# EAGLE design audiolase (EAGLE 5.11)
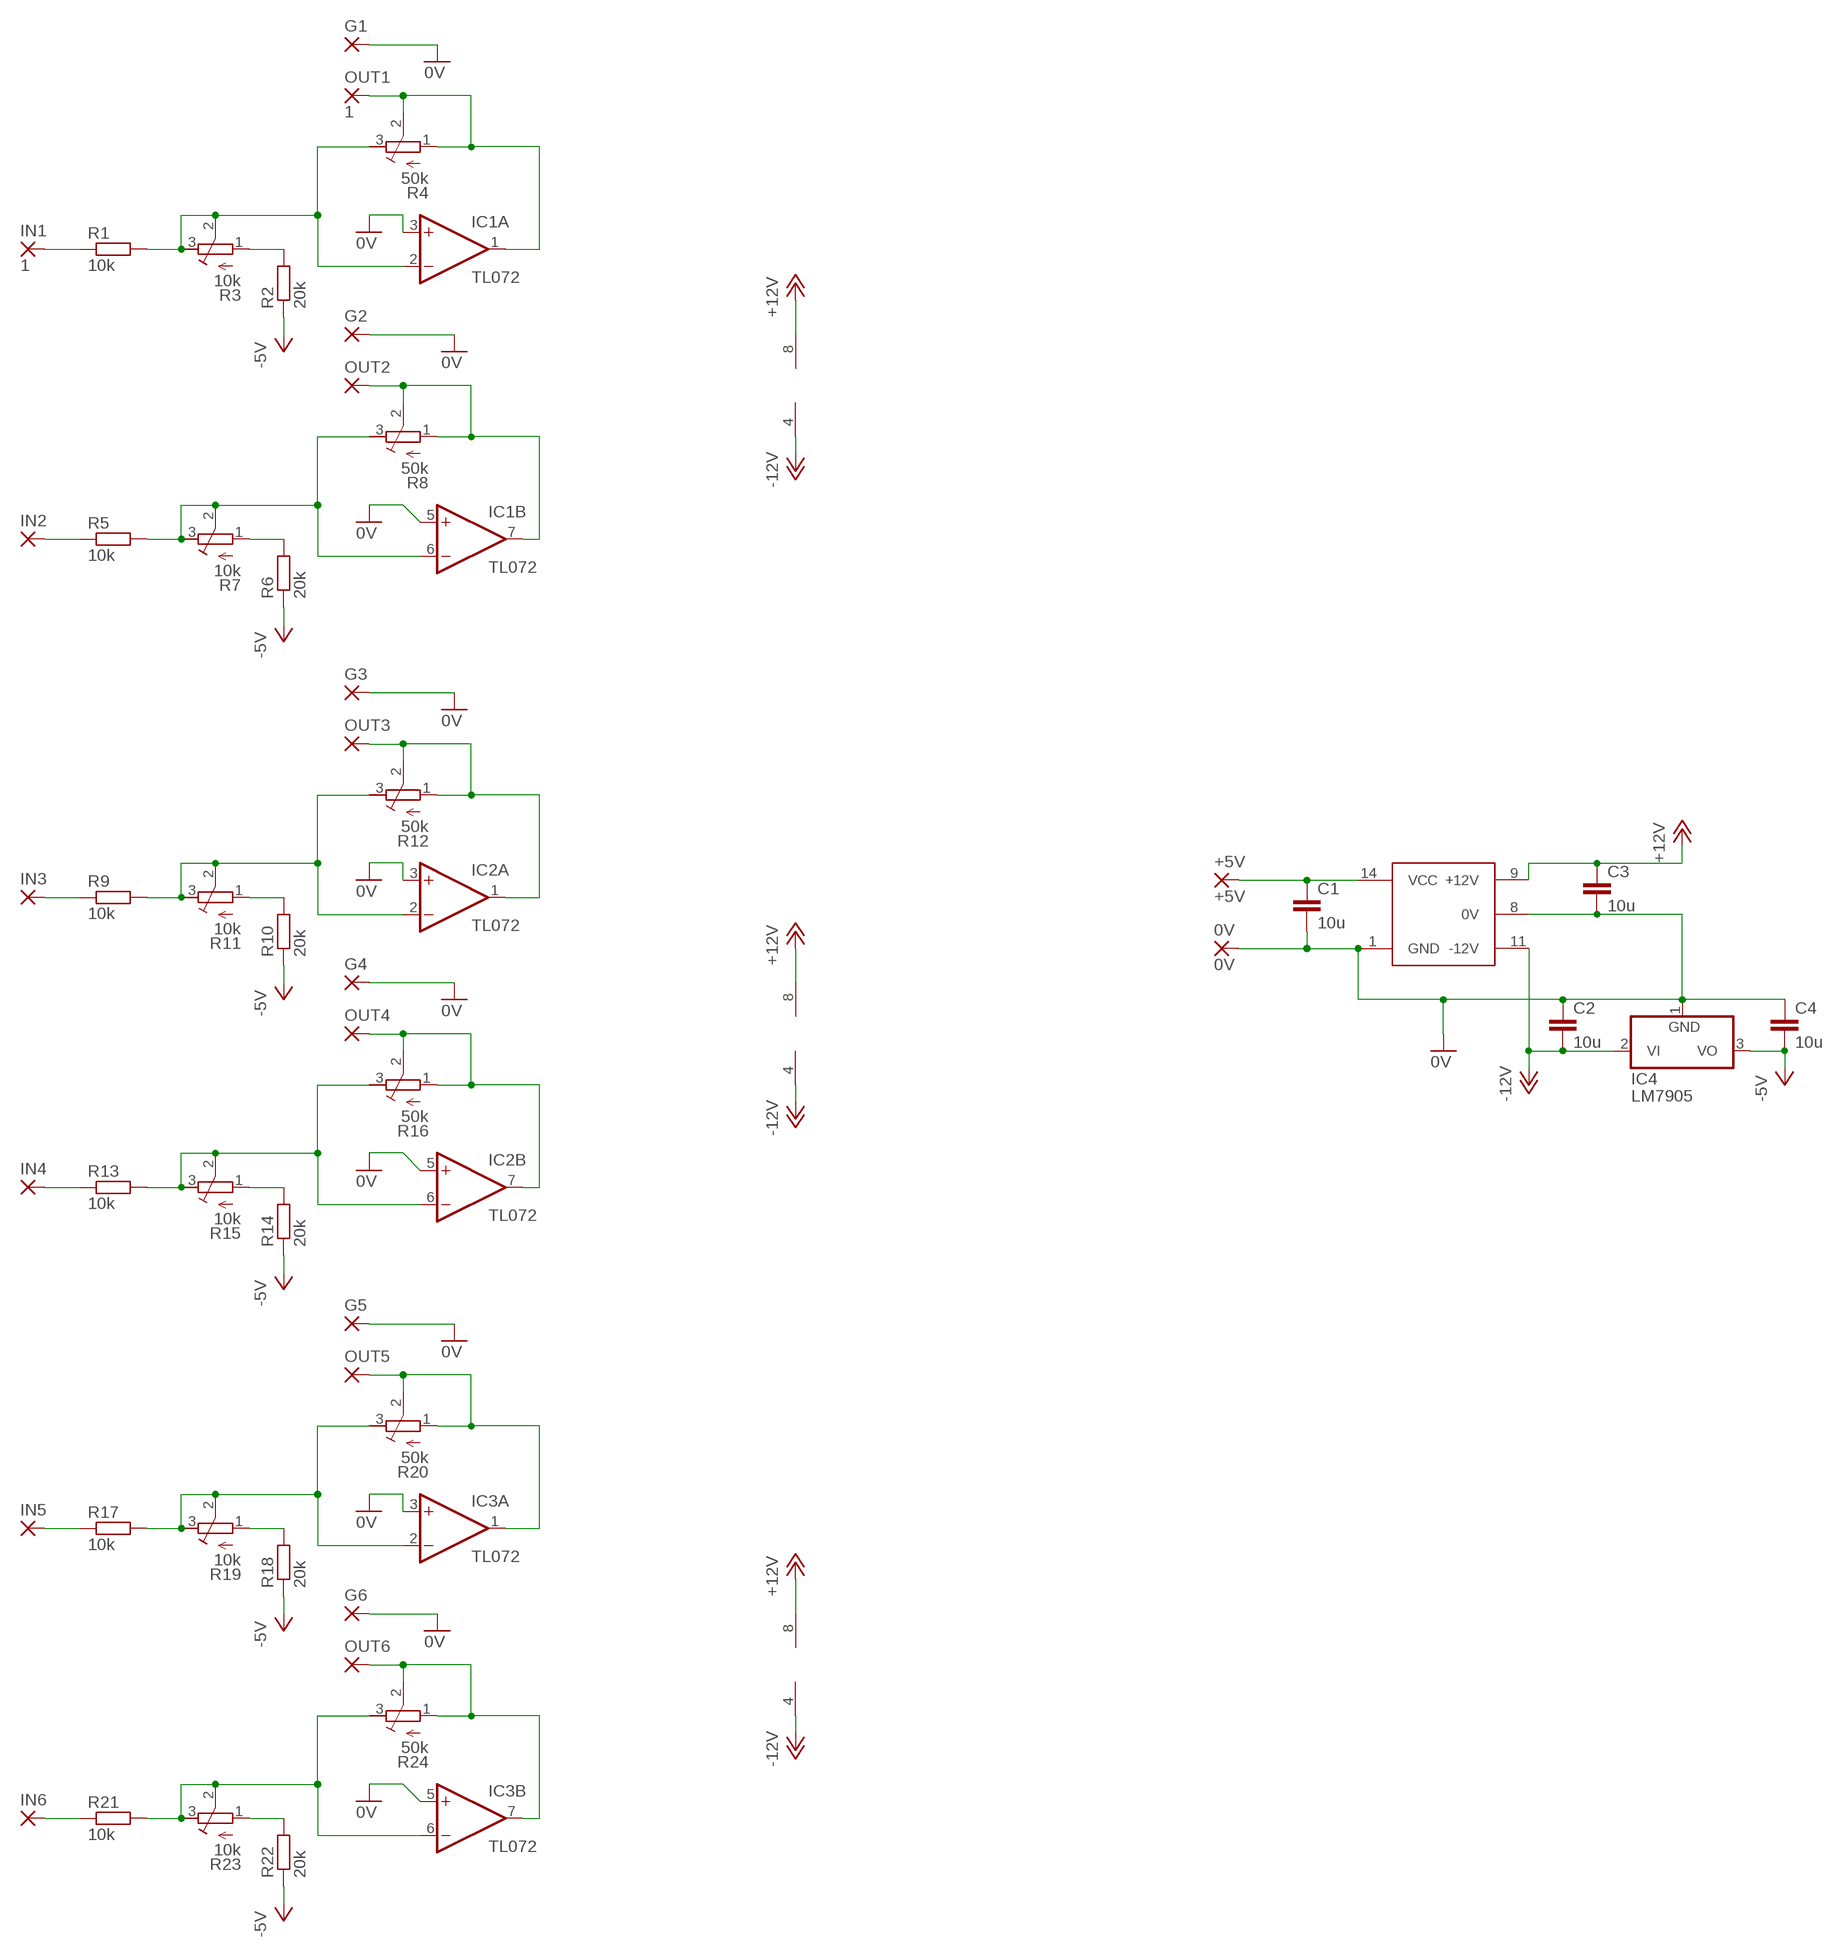
[diagram p0: schematic, sheet 1]

## Parts
0V  0V  2,54/1,0  [2,54/1,0]
+5V  +5V  2,54/1,0  [2,54/1,0]
C1  10u  C-EU075-042X103  [C075-042X103]
C2  10u  C-EU075-042X103  [C075-042X103]
C3  10u  C-EU075-042X103  [C075-042X103]
C4  10u  C-EU075-042X103  [C075-042X103]
G1  2,54/1,0  [2,54/1,0]
G2  2,54/1,0  [2,54/1,0]
G3  2,54/1,0  [2,54/1,0]
G4  2,54/1,0  [2,54/1,0]
G5  2,54/1,0  [2,54/1,0]
G6  2,54/1,0  [2,54/1,0]
IC1  TL072  2AMP_P8+4N  [DIL08]
IC2  TL072  2AMP_P8+4N  [DIL08]
IC3  TL072  2AMP_P8+4N  [DIL08]
IC4  LM7905  7905T  [TO220H]
IN1  1  2,54/1,0  [2,54/1,0]
IN2  2,54/1,0  [2,54/1,0]
IN3  2,54/1,0  [2,54/1,0]
IN4  2,54/1,0  [2,54/1,0]
IN5  2,54/1,0  [2,54/1,0]
IN6  2,54/1,0  [2,54/1,0]
OUT1  1  2,54/1,0  [2,54/1,0]
OUT2  2,54/1,0  [2,54/1,0]
OUT3  2,54/1,0  [2,54/1,0]
OUT4  2,54/1,0  [2,54/1,0]
OUT5  2,54/1,0  [2,54/1,0]
OUT6  2,54/1,0  [2,54/1,0]
R1  10k  R-EU_0207/10  [0207/10]
R2  20k  R-EU_0207/10  [0207/10]
R3  10k  R-TRIMM3299W  [RTRIM3299W]
R4  50k  R-TRIMM3299W  [RTRIM3299W]
R5  10k  R-EU_0207/10  [0207/10]
R6  20k  R-EU_0207/10  [0207/10]
R7  10k  R-TRIMM3299W  [RTRIM3299W]
R8  50k  R-TRIMM3299W  [RTRIM3299W]
R9  10k  R-EU_0207/10  [0207/10]
R10  20k  R-EU_0207/10  [0207/10]
R11  10k  R-TRIMM3299W  [RTRIM3299W]
R12  50k  R-TRIMM3299W  [RTRIM3299W]
R13  10k  R-EU_0207/10  [0207/10]
R14  20k  R-EU_0207/10  [0207/10]
R15  10k  R-TRIMM3299W  [RTRIM3299W]
R16  50k  R-TRIMM3299W  [RTRIM3299W]
R17  10k  R-EU_0207/10  [0207/10]
R18  20k  R-EU_0207/10  [0207/10]
R19  10k  R-TRIMM3299W  [RTRIM3299W]
R20  50k  R-TRIMM3299W  [RTRIM3299W]
R21  10k  R-EU_0207/10  [0207/10]
R22  20k  R-EU_0207/10  [0207/10]
R23  10k  R-TRIMM3299W  [RTRIM3299W]
R24  50k  R-TRIMM3299W  [RTRIM3299W]
U$1  IA0512D  [IA0512D]

## Nets
0V: 0V.1(P) C1.2 C2.1 C3.2 C4.1 G1.1(P) G2.1(P) G3.1(P) G4.1(P) G5.1(P) G6.1(P) IC1.3(A:+IN) IC1.5(B:+IN) IC2.3(A:+IN) IC2.5(B:+IN) IC3.3(A:+IN) IC3.5(B:+IN) IC4.1(GND) U$1.1(GND) U$1.8(0V)
+12V: C3.1 IC1.8(P:V+) IC2.8(P:V+) IC3.8(P:V+) U$1.9(+12V)
-5V: C4.2 IC4.3(VO) R2.1 R6.1 R10.1 R14.1 R18.1 R22.1
-12V: C2.2 IC1.4(P:V-) IC2.4(P:V-) IC3.4(P:V-) IC4.2(VI) U$1.11(-12V)
N$1: IN1.1(P) R1.1
N$2: IC1.2(A:-IN) R1.2 R3.2(S) R3.3(A) R4.3(A)
N$3: R2.2 R3.1(E)
N$4: IC1.1(A:OUT) OUT1.1(P) R4.1(E) R4.2(S)
N$5: IN2.1(P) R5.1
N$6: IC1.6(B:-IN) R5.2 R7.2(S) R7.3(A) R8.3(A)
N$7: IC1.7(B:OUT) OUT2.1(P) R8.1(E) R8.2(S)
N$8: R6.2 R7.1(E)
N$9: IN3.1(P) R9.1
N$10: IC2.2(A:-IN) R9.2 R11.2(S) R11.3(A) R12.3(A)
N$11: IC2.1(A:OUT) OUT3.1(P) R12.1(E) R12.2(S)
N$12: R10.2 R11.1(E)
N$13: IN4.1(P) R13.1
N$14: IC2.6(B:-IN) R13.2 R15.2(S) R15.3(A) R16.3(A)
N$15: IC2.7(B:OUT) OUT4.1(P) R16.1(E) R16.2(S)
N$16: R14.2 R15.1(E)
N$17: IN5.1(P) R17.1
N$18: IC3.2(A:-IN) R17.2 R19.2(S) R19.3(A) R20.3(A)
N$19: IC3.1(A:OUT) OUT5.1(P) R20.1(E) R20.2(S)
N$20: R18.2 R19.1(E)
N$21: IN6.1(P) R21.1
N$22: IC3.6(B:-IN) R21.2 R23.2(S) R23.3(A) R24.3(A)
N$23: IC3.7(B:OUT) OUT6.1(P) R24.1(E) R24.2(S)
N$24: R22.2 R23.1(E)
N$25: +5V.1(P) C1.1 U$1.14(VCC)

## Library data of the parts
0V +5V G1-G6 IN1-IN6 OUT1-OUT6 = wirepad:2,54/1,0: THROUGH-HOLE PAD
C1-C4 = resistor:C-EU: CAPACITOR, European symbol
IC1-IC3 = linear:2AMP_P8+4: OP AMP
IC4 = linear:79*: Negative VOLTAGE REGULATOR
R1 R2 R5 R6 R9 R10 R13 R14 R17 R18 R21 R22 = resistor:R-EU_: RESISTOR, European symbol
R3 R4 R7 R8 R11 R12 R15 R16 R19 R20 R23 R24 = resistor:R-TRIMM: Trimm resistor
U$1 = russ:IA0512D

## Board
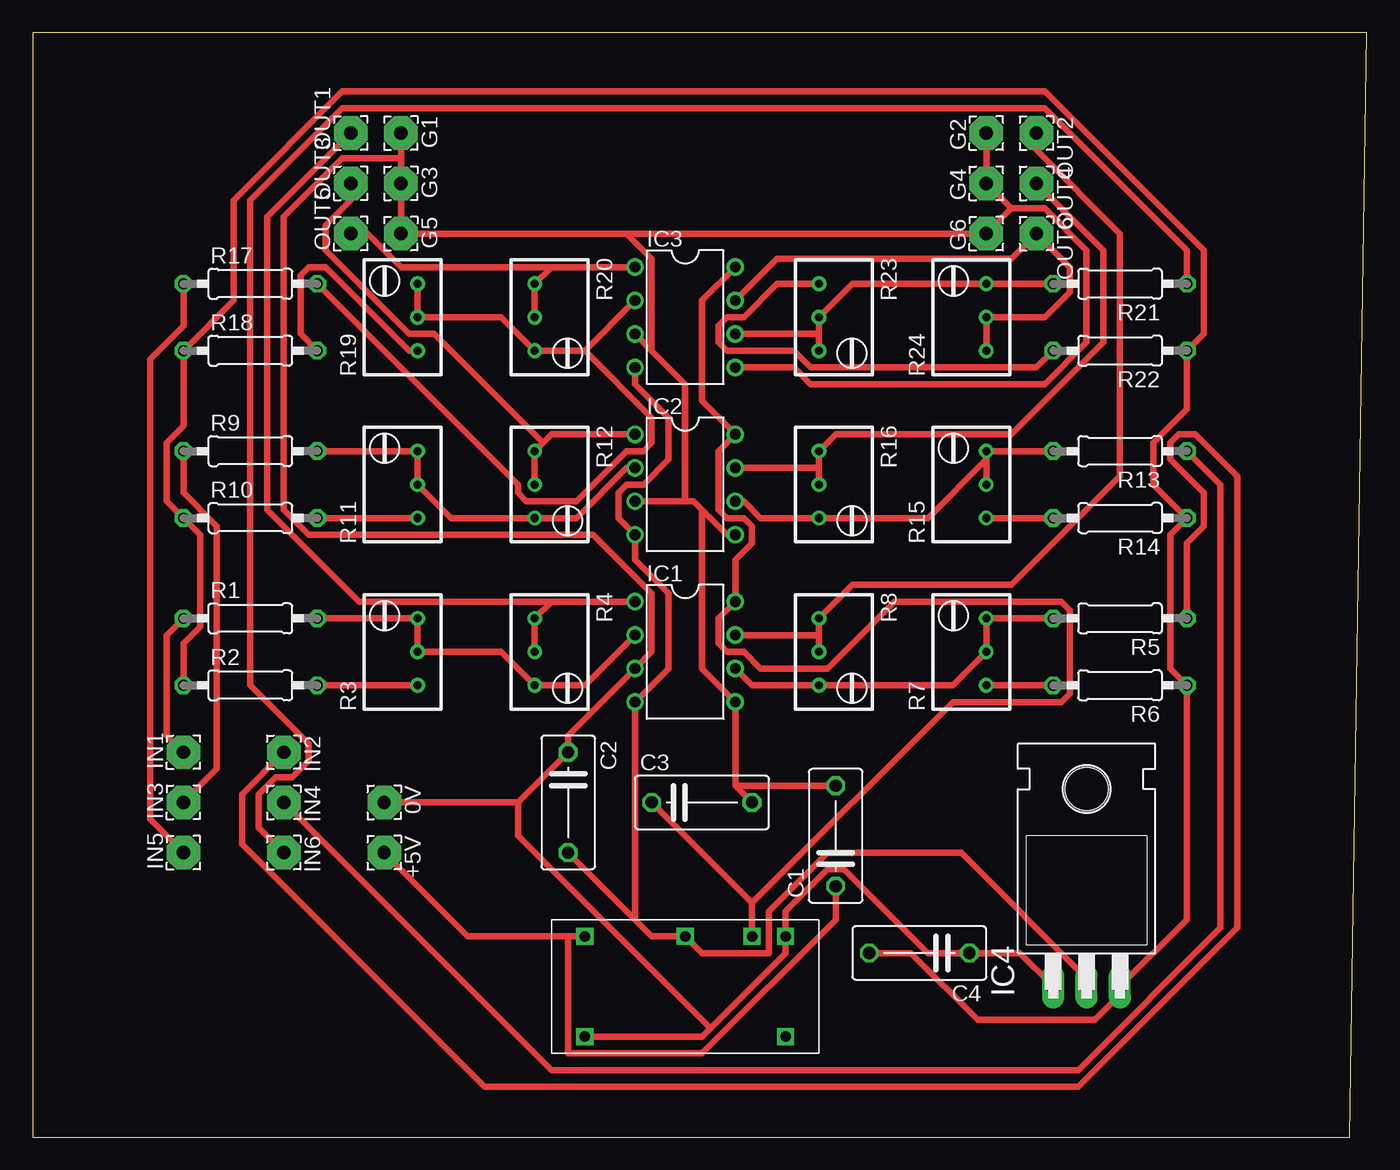
[diagram p1: board, top side]

Size 101.27 x 83.81 mm. Coordinates in mm from the lower left corner, seen from the top.
Outline: 0,0 100,0 101.27,83.81 0,83.81 0,0
Copper layers (1*16): Top 0.035mm / dielectric 1.5mm / Bottom 0.035mm
Design rules "default *": minimum track width 20mil, minimum drill 24mil, track to track 8mil, track to pad 8mil, pad to pad 8mil, via to via 8mil, smd to smd 8mil, copper to edge 30mil, drill to drill 8mil, minimum pad ring 10mil, minimum via ring 8mil, stop-mask expansion 4mil, vias tented up to drill 0mil, thermal gap 10mil

### Footprints (pad centres in the part's own frame; a part is rotated, then mirrored left to right if it is on the bottom)
2,54/1,0 = drill 1.016 pad 2.54 octagon: 1 0,0
C075-042X103 = drill 0.914 octagon: 1 -3.81,0; 2 3.81,0
DIL08 = drill 0.813 pad 1.27 round: 1 -3.81,-3.81; 2 -1.27,-3.81; 3 1.27,-3.81; 4 3.81,-3.81; 5 3.81,3.81; 6 1.27,3.81; 7 -1.27,3.81; 8 -3.81,3.81
TO220H = drill 1.118 long: 1 -2.54,-10.16; 2 0,-10.16; 3 2.54,-10.16 | hole 3.302: 0,4.826
0207/10 = drill 0.813 octagon: 1 -5.08,0; 2 5.08,0
RTRIM3299W = drill 0.61 round: 1 1.27,-2.54; 2 1.27,0; 3 1.27,2.54
IA0512D = drill 0.8 square: 1 2.54,1.27; 7 17.78,1.27; 8 17.78,8.89; 9 15.24,8.89; 11 10.16,8.89; 14 2.54,8.89

### Placement (x,y rotation side)
0V  26.67,25.4 270 top
+5V  26.67,21.59 270 top
C1  60.96,22.86 90 top
C2  40.64,25.4 270 top
C3  50.8,25.4 0 top
C4  67.31,13.97 180 top
G1  27.94,76.2 270 top
G2  72.39,76.2 90 top
G3  27.94,72.39 270 top
G4  72.39,72.39 90 top
G5  27.94,68.58 270 top
G6  72.39,68.58 90 top
IC1  49.53,36.83 270 top
IC2  49.53,49.53 270 top
IC3  49.53,62.23 270 top
IC4  80.01,21.59 0 top
IN1  11.43,29.21 90 top
IN2  19.05,29.21 270 top
IN3  11.43,25.4 90 top
IN4  19.05,25.4 270 top
IN5  11.43,21.59 90 top
IN6  19.05,21.59 270 top
OUT1  24.13,76.2 90 top
OUT2  76.2,76.2 270 top
OUT3  24.13,72.39 90 top
OUT4  76.2,72.39 270 top
OUT5  24.13,68.58 90 top
OUT6  76.2,68.58 270 top
R1  16.51,39.37 0 top
R2  16.51,34.29 0 top
R3  27.94,36.83 0 top
R4  39.37,36.83 180 top
R5  82.55,39.37 180 top
R6  82.55,34.29 180 top
R7  71.12,36.83 0 top
R8  60.96,36.83 180 top
R9  16.51,52.07 0 top
R10  16.51,46.99 0 top
R11  27.94,49.53 0 top
R12  39.37,49.53 180 top
R13  82.55,52.07 180 top
R14  82.55,46.99 180 top
R15  71.12,49.53 0 top
R16  60.96,49.53 180 top
R17  16.51,64.77 0 top
R18  16.51,59.69 0 top
R19  27.94,62.23 0 top
R20  39.37,62.23 180 top
R21  82.55,64.77 180 top
R22  82.55,59.69 180 top
R23  60.96,62.23 180 top
R24  71.12,62.23 0 top
U$1  39.37,6.35 0 top

### Tracks (layer width: path | path; a pad name or v marks a point on that pad's centre or on a via)
0V
  Top 0.508: 36.83,25.4 0V.1 | 36.83,25.4 C2.1 40.64,30.48 IC1.3 46.99,36.83 46.99,41.27 42.55,45.72 20.95,45.72 19.05,47.62 19.05,69.85 23.5,74.3 27.94,74.3 | IC4.1 74.93,13.97 C4.1 67.94,13.97 61.59,20.32 60.33,20.32 57.15,17.14 U$1.8 57.15,13.97 51.44,8.26 | U$1.1 50.8,7.62 51.44,8.26 | 36.83,25.4 36.83,22.86 51.44,8.26 | IC3.5 57.78,58.42 59.05,57.15 76.83,57.15 80.01,60.33 80.01,67.31 76.83,70.48 74.3,70.48 | 74.3,70.48 G4.1 G2.1 | 74.3,70.48 G6.1 45.09,68.58 | 53.34,26.67 IC1.5 50.8,35.56 50.8,47.62 | 53.34,26.67 C3.2 | 53.34,26.67 C1.2 | 27.94,74.3 G3.1 G5.1 45.09,68.58 | 27.94,74.3 G1.1 | 49.53,48.26 50.16,48.26 50.8,47.62 | 49.53,48.26 IC2.3 | 50.8,47.62 52.7,45.72 IC2.5 | 46.99,59.69 49.53,57.15 49.53,48.26 | 46.99,59.69 IC3.3 | 45.09,68.58 46.99,66.67 46.99,59.69
+12V
  Top 0.508: U$1.9 54.61,17.78 | 54.61,17.78 C3.1 | IC3.8 50.8,63.5 50.8,55.88 IC2.8 52.07,52.07 52.07,47.62 52.7,46.99 53.98,46.99 54.61,46.35 54.61,45.09 53.34,43.81 IC1.8 52.07,39.37 52.07,37.47 52.7,36.83 53.98,36.83 55.24,35.56 60.33,35.56 65.41,40.64 78.11,40.64 78.74,40.01 78.74,33.66 78.11,33.02 69.85,33.02 54.61,17.78
-5V
  Top 0.508: R2.1 11.43,37.47 12.7,38.73 12.7,45.72 R10.1 10.16,48.26 10.16,52.7 11.43,53.98 R18.1 15.24,63.5 15.24,71.12 23.5,79.38 76.83,79.38 88.9,67.31 88.9,60.96 R22.1 87.63,55.24 85.09,52.7 85.09,49.53 R14.1 86.36,45.72 86.36,35.56 R6.1 87.63,16.51 IC4.3 82.55,10.79 80.64,8.89 71.75,8.89 66.67,13.97 C4.2
-12V
  Top 0.508: C2.2 45.72,16.51 | 45.72,16.51 46.99,15.24 U$1.11 50.8,13.97 55.88,13.97 55.88,17.14 60.33,21.59 70.48,21.59 80.01,12.06 IC4.2 | 45.72,16.51 IC1.4 48.26,35.56 48.26,41.27 45.72,43.81 IC2.4 44.45,46.99 44.45,48.9 45.09,49.53 46.35,49.53 48.26,51.44 48.26,54.61 45.72,57.15 IC3.4
N$1
  Top 0.508: R1.1 10.16,38.1 10.16,30.48 IN1.1
N$2
  Top 0.508: R1.2 R3.3 R3.2 35.56,36.83 R4.3 41.91,34.29 IC1.2
N$3
  Top 0.508: R2.2 R3.1
N$4
  Top 0.508: R4.2 R4.1 39.37,40.64 | 39.37,40.64 IC1.1 | OUT1.1 17.78,69.85 17.78,47.62 24.77,40.64 39.37,40.64
N$5
  Top 0.508: R5.1 87.63,45.09 88.9,46.35 88.9,48.9 86.36,51.44 86.36,52.7 87,53.34 88.27,53.34 91.44,50.16 91.44,15.88 79.38,3.81 34.29,3.81 15.88,22.23 15.88,26.04 IN2.1
N$6
  Top 0.508: IC1.6 54.61,34.29 R8.3 69.85,34.29 R7.2 R7.3 R5.2
N$7
  Top 0.508: 59.69,38.1 R8.1 62.23,41.91 74.3,41.91 82.55,50.16 82.55,68.58 76.2,74.93 OUT2.1 | 59.69,38.1 R8.2 | IC1.7 59.69,38.1
N$8
  Top 0.508: R7.1 R6.2
N$9
  Top 0.508: R9.1 11.43,48.9 13.97,46.35 13.97,27.94 IN3.1
N$10
  Top 0.508: R9.2 R11.3 R11.2 31.75,46.99 R12.3 41.27,46.99 45.09,50.8 IC2.2
N$11
  Top 0.508: R12.2 R12.1 38.73,52.7 | IC2.1 39.37,53.34 38.73,52.7 | OUT3.1 24.13,71.12 22.23,69.22 22.23,67.31 28.57,60.96 30.48,60.96 38.73,52.7
N$12
  Top 0.508: R10.2 R11.1
N$13
  Top 0.508: R13.1 90.17,49.53 90.17,15.88 79.38,5.08 39.37,5.08 IN4.1
N$14
  Top 0.508: IC2.6 53.98,48.26 55.24,46.99 R16.3 67.94,46.99 72.39,51.44 | 72.39,51.44 R15.3 R13.2 | 72.39,51.44 R15.2
N$15
  Top 0.508: 59.69,50.8 R16.1 60.96,53.34 74.3,53.34 81.28,60.33 81.28,67.31 OUT4.1 | 59.69,50.8 R16.2 | IC2.7 59.69,50.8
N$16
  Top 0.508: R15.1 R14.2
N$17
  Top 0.508: R17.1 11.43,61.59 8.89,59.05 8.89,24.13 IN5.1
N$18
  Top 0.508: R19.3 R19.2 35.56,62.23 R20.3 41.91,59.69 | 41.91,59.69 IC3.2 | R17.2 36.83,49.53 36.83,48.9 37.47,48.26 41.27,48.26 45.09,52.07 46.35,52.07 46.99,52.7 46.99,54.61 41.91,59.69
N$19
  Top 0.508: R20.2 R20.1 39.37,66.04 | 39.37,66.04 IC3.1 | OUT5.1 25.4,68.58 27.94,66.04 39.37,66.04
N$20
  Top 0.508: R19.1 28.57,59.69 22.23,66.04 20.95,66.04 20.32,65.41 20.32,60.96 R18.2
N$21
  Top 0.508: R21.1 87.63,67.31 76.83,78.11 23.5,78.11 16.51,71.12 16.51,34.29 20.95,29.84 20.95,28.57 19.68,27.3 18.41,27.3 17.14,26.04 17.14,23.5 IN6.1
N$22
  Top 0.508: R21.2 R24.3 62.23,64.77 R23.2 59.69,60.96 | 59.69,60.96 R23.3 | IC3.6 59.69,60.96
N$23
  Top 0.508: R24.1 R24.2 76.83,62.23 78.74,64.14 78.74,66.04 OUT6.1 74.3,66.67 56.52,66.67 IC3.7
N$24
  Top 0.508: R23.1 56.52,64.77 53.98,62.23 52.7,62.23 52.07,61.59 52.07,60.33 52.7,59.69 57.78,59.69 59.05,58.42 76.2,58.42 R22.2
N$25
  Top 0.508: 40.64,15.24 33.02,15.24 +5V.1 | 40.64,15.24 U$1.14 | C1.1 60.96,16.51 50.8,6.35 40.64,6.35 40.64,15.24